# EasyEDA Pro project ad9854_lvgl.epro

# Schematic Schematic1
Board Name: Board2; Create Date: 2025-04-08; Page Name: P1; Project Name: ad9854+lvgl; Schematic Name: Schematic1; Update Date: 2025-04-08; Company: 嘉立创EDA; Page Size: A4; Version: V1.0
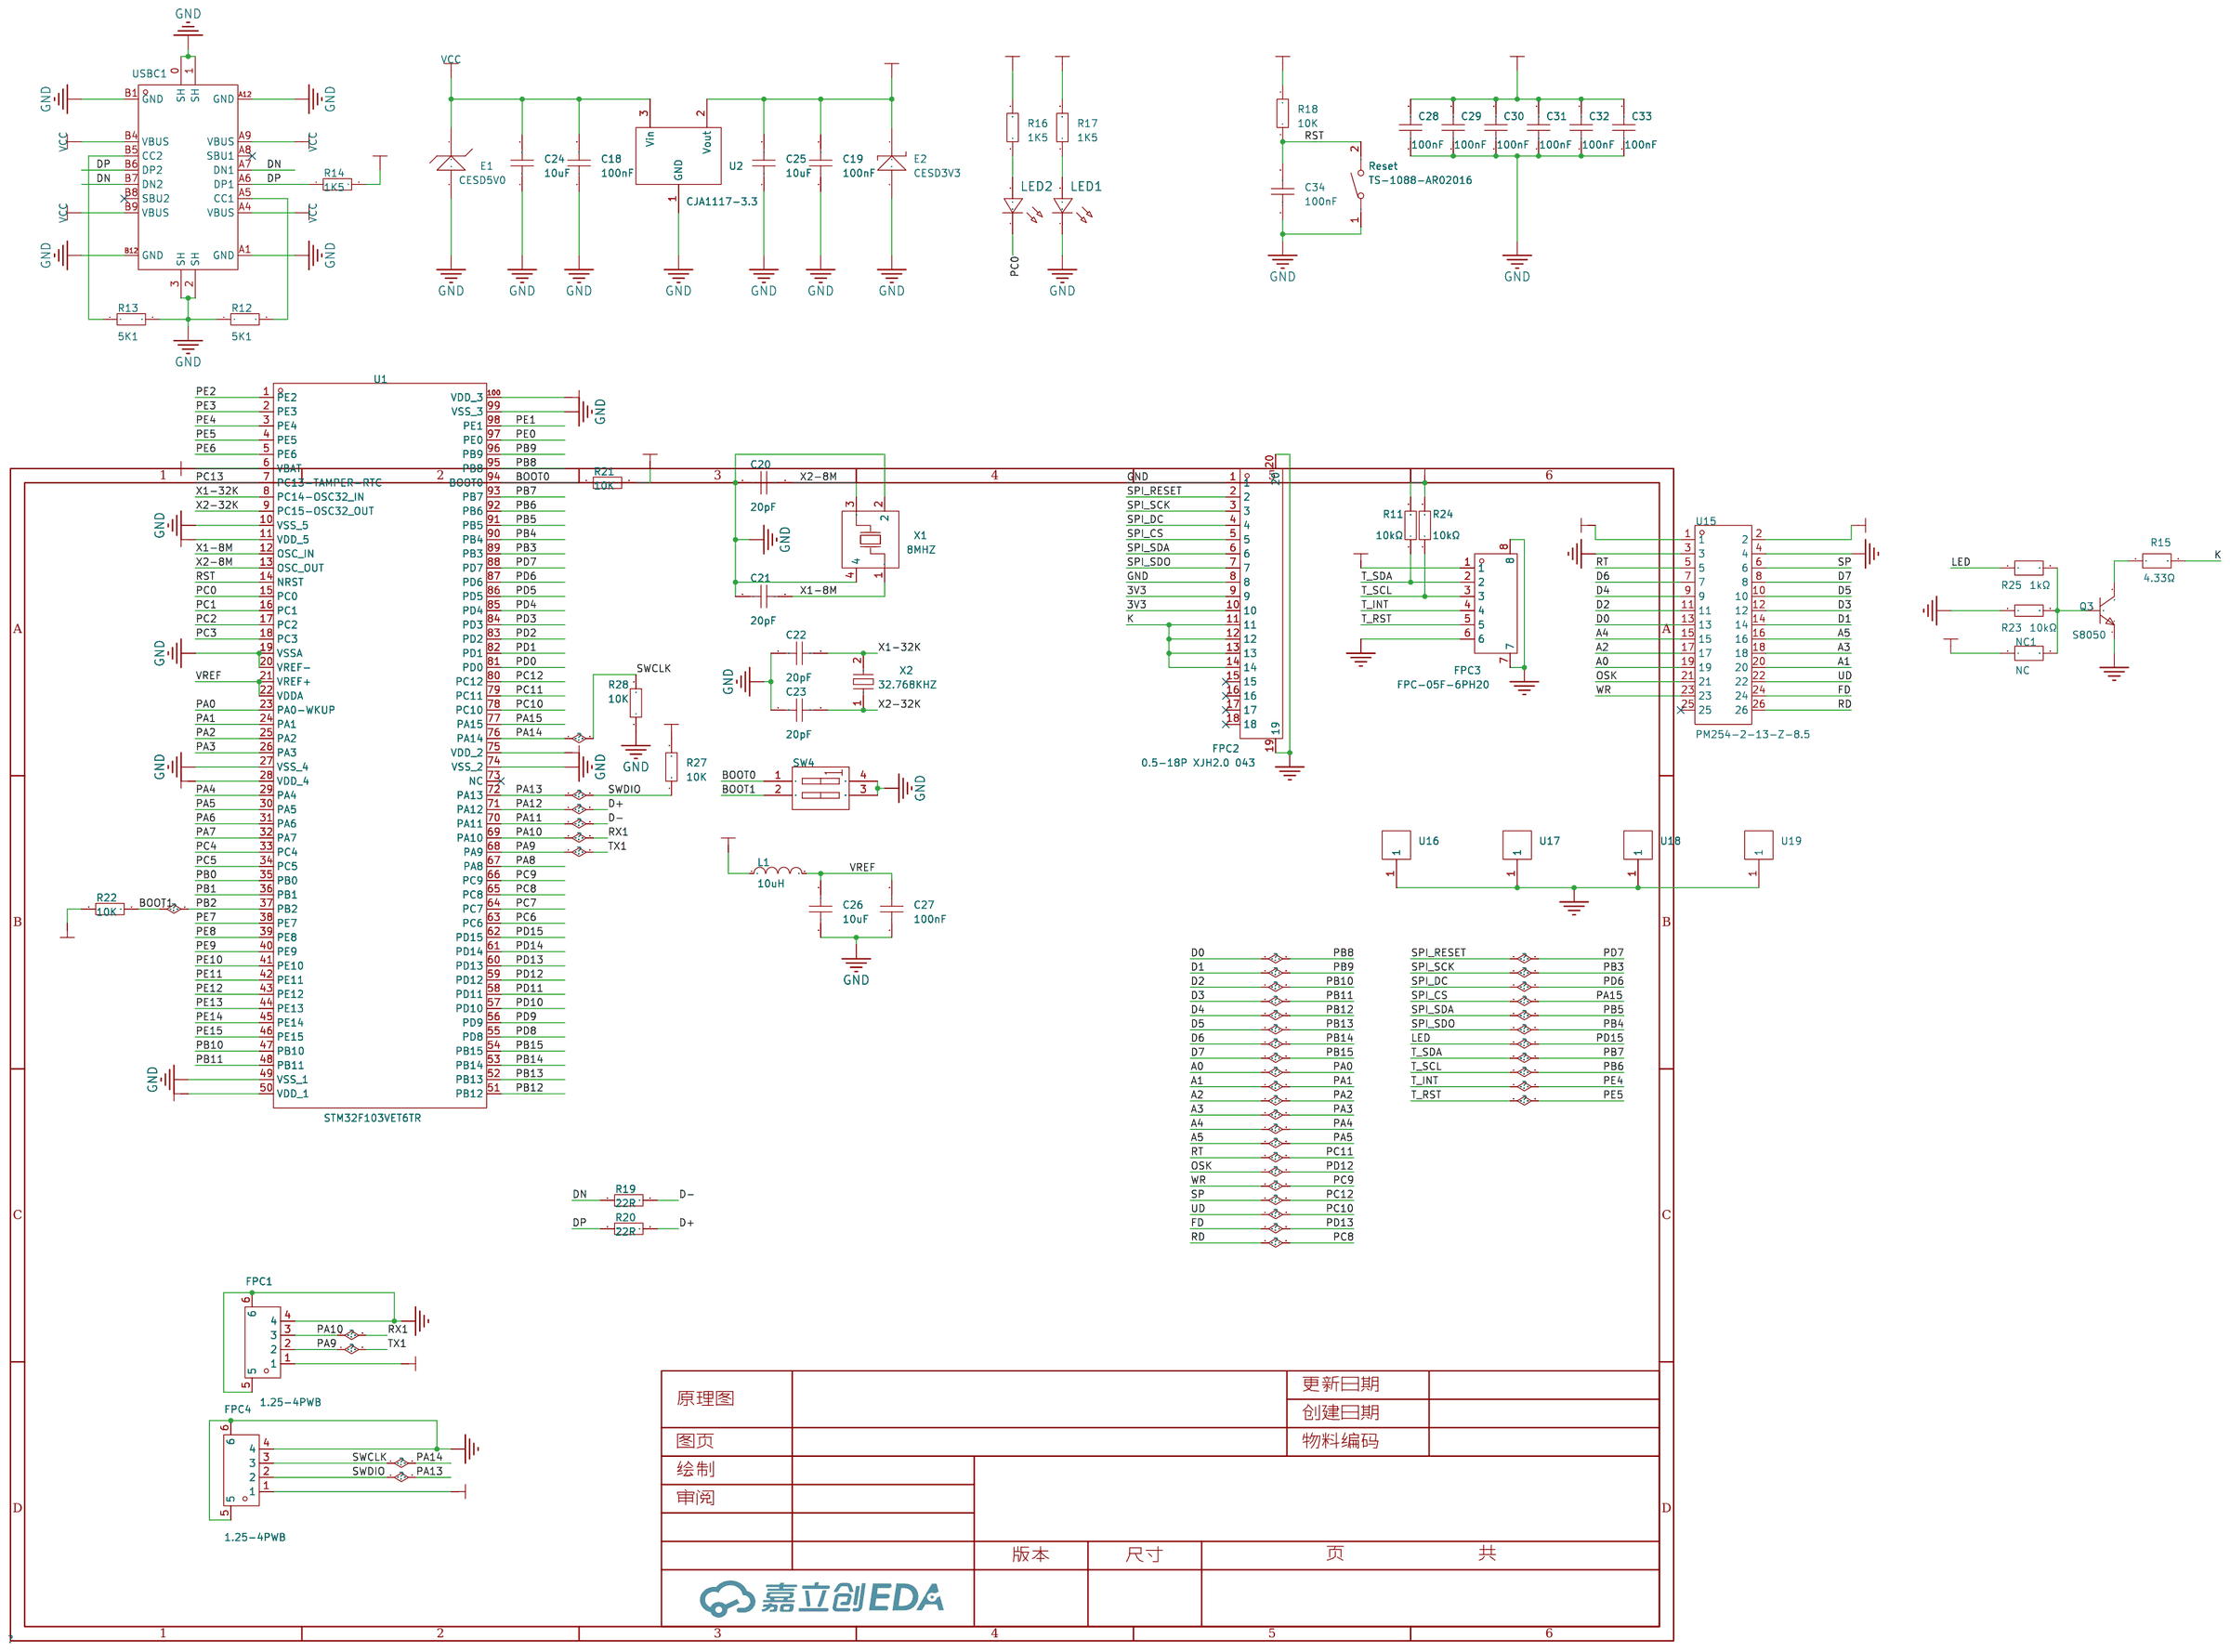
[diagram p0: schematic sheet]

## Parts
C18  100nF  [C0402]
C19  100nF  [C0402]
C20  20pF  [C0402]
C21  20pF  [C0402]
C22  20pF  [C0402]
C23  20pF  [C0402]
C24  10uF  [C0402]
C25  10uF  [C0402]
C26  10uF  [C0402]
C27  100nF  [C0402]
C28  100nF  [C0402]
C29  100nF  [C0402]
C30  100nF  [C0402]
C31  100nF  [C0402]
C32  100nF  [C0402]
C33  100nF  [C0402]
C34  100nF  [C0402]
E1  CESD5V0  [SOD-323_L1.8-W1.3-LS2.5-RD]
E2  CESD3V3  [SOD-323_L1.8-W1.3-LS2.5-RD]
FPC1  1.25-4PWB  [CONN-SMD_1.25-4PWB]
FPC2  0.5-18P XJH2.0 043  [FPC-SMD_18P-P0.50_XW05200-18]
FPC3  FPC-05F-6PH20  [FPC-SMD_6P-P0.50_XUNPU_FPC-05F-6PH20]
FPC4  1.25-4PWB  [CONN-SMD_1.25-4PWB]
L1  10uH  [L0603]
LED1  -  [LED_0603]
LED2  -  [LED_0603]
NC1  NC  [R0402]
Q3  S8050  [SOT-23-3_L2.9-W1.6-P1.90-LS2.8-BR]
R11  10kΩ  [R0402]
R12  5K1  [R0402]
R13  5K1  [R0402]
R14  1K5  [R0402]
R15  4.33Ω  [R0603]
R16  1K5  [R0402]
R17  1K5  [R0402]
R18  10K  [R0402]
R19  22R  [R0402]
R20  22R  [R0402]
R21  10K  [R0402]
R22  10K  [R0402]
R23  10kΩ  [R0402]
R24  10kΩ  [R0402]
R25  1kΩ  [R0402]
R27  10K  [R0402]
R28  10K  [R0402]
Reset  TS-1088-AR02016  [SW-SMD_L3.9-W3.0-P4.45]
SW4  DSHP02TSGET  [SW-SMD_4P_DSHP02TSGET]
U1  STM32F103VET6TR  [LQFP-100_L14.0-W14.0-P0.50-LS16.0-BL]
U2  CJA1117-3.3  [SOT-89-3_L4.5-W2.5-P1.50-LS4.2-BR]
U15  PM254-2-13-Z-8.5  [HDR-TH_26P-P2.54-V-F-R2-C13-S2.54-1]
U16  -  [M3梅花螺丝孔]
U17  -  [M3梅花螺丝孔]
U18  -  [M3梅花螺丝孔]
U19  -  [M3梅花螺丝孔]
USBC1  TYPE-C-31-M-12  [USB-C_SMD-TYPE-C-31-M-12]
X1  8MHZ  [OSC-SMD_4P-L3.2-W2.5-BL]
X2  32.768KHZ  [OSC-SMD_L3.2-W1.5]

## Library data of the parts
C18-C34 = CAP_0402: Supplier Footprint: 0402
E1 = CESD5V0D3 ZA: 极性:单向;反向截止电压(Vrwm):5V;击穿电压(VBR):6.2V;钳位电压(Vc)@Ipp:15.5V;; LCSC Part Name: 单向ESD; Supplier Part: C22643; Manufacturer: CJ(江苏长电/长晶); Supplier Footprint: SOD-323; JLCPCB Part Class: Extended Part; Datasheet: https://atta.szlcsc.com/upload/public/pdf/source/20140301/1457707004115.pdf; Supplier: LCSC; Polarity: 单向; Reverse Stand-Off Voltage (Vrwm): 5V; Breakdown Voltage (VBR): 6.2V; Peak Pulse Current(Ipp)@8/20us: 15A; Clamping Voltage@Ipp: 15.5V
E2 = CESD3V3D3 YU: 极性:单向;反向截止电压(Vrwm):3.3V;击穿电压(VBR):5V;钳位电压(Vc)@Ipp:13V;; LCSC Part Name: 单向ESD; Supplier Part: C38388; Manufacturer: CJ(江苏长电/长晶); Supplier Footprint: SOD-323; JLCPCB Part Class: Extended Part; Datasheet: https://atta.szlcsc.com/upload/public/pdf/source/20150915/1457707371129.pdf; Supplier: LCSC; Polarity: 单向; Reverse Stand-Off Voltage (Vrwm): 3.3V; Breakdown Voltage (VBR): 5V; Peak Pulse Current(Ipp)@8/20us: 16A; Clamping Voltage@Ipp: 13V
FPC1 FPC4 = 1.25-4PWB: 插针结构:1x4P;间距:1.25mm;安装方式:卧贴;参考系列:-;总PIN数:4P;排数:1;每排PIN数:4;行距:-;额定电流:-;工作温度范围:-40℃~+85℃;; LCSC Part Name: 1x4P 间距:1.25mm 卧贴; Supplier Part: C2905011; Manufacturer: DEALON(德艺隆); Supplier Footprint: SMD,P=1.25mm,卧贴; JLCPCB Part Class: 扩展库; Datasheet: https://atta.szlcsc.com/upload/public/pdf/source/20231123/1AE0876AE9C7DCFC0D68EAC4CBA881B0.pdf; Supplier: LCSC; Pins Structure: 1x4P; Pitch: 1.25mm; Mounting Style: 卧贴; Number of Pins: 4P; Number of Rows: 1; Number of PINs Per Row: 4; Operating Temperature Range: -40℃~+85℃
FPC2 = 0.5-18P XJH2.0 043: 锁定特性:翻盖式;触点类型:下接;触点数量:18P;间距:0.5mm;安装类型:卧贴;工作温度范围:-55℃~+85℃;; LCSC Part Name: 翻盖式 下接 P数:18P 间距:0.5mm; Supplier Part: C5373437; Manufacturer: SHOU HAN(首韩); Supplier Footprint: SMD,P=0.5mm,卧贴; JLCPCB Part Class: 扩展库; Datasheet: https://atta.szlcsc.com/upload/public/pdf/source/20230321/2194CD91B42FC0309001838B2742DAF5.pdf; Supplier: LCSC; Locking Feature: 翻盖式; Contact Type: 下接; Number of Contacts: 18P; Pitch: 0.5mm; Mounting Type: 卧贴; FFC, FCB Thickness: 0.3mm; Height Above Board: 2mm; Contact Material: 黄铜; Contact Plating: 锡; Operating Temperature Range: -55℃~+85℃
FPC3 = FPC-05F-6PH20: 锁定特性:翻盖式;触点类型:下接;触点数量:6P;间距:0.5mm;安装类型:卧贴;工作温度范围:-25℃~+85℃;; LCSC Part Name: 间距:0.5mm P数:6P 翻盖式 下接; Supplier Part: C2856796; Manufacturer: XUNPU(讯普); Supplier Footprint: SMD,P=0.5mm,卧贴; JLCPCB Part Class: 扩展库; Datasheet: https://atta.szlcsc.com/upload/public/pdf/source/20210922/16B003FB53336DDF6538142CC465AC4D.pdf; Supplier: LCSC; Locking Feature: 翻盖式; Contact Type: 下接; Number of Contacts: 6P; Pitch: 0.5mm; Mounting Type: 卧贴; FFC, FCB Thickness: 0.3mm; Height Above Board: 2mm; Operating Temperature Range: -25℃~+85℃
L1 = L_0603
LED1 LED2 = LED_0603-R: Supplier Footprint: 0603
NC1 R25 = RT0402BRD071KL: 电阻类型:薄膜电阻;阻值:1kΩ;精度:±0.1%;功率:62.5mW;最大工作电压:50V;温度系数:±25ppm/℃;; LCSC Part Name: 薄膜电阻 1kΩ ±0.1% 62.5mW; Supplier Part: C852624; Manufacturer: YAGEO(国巨); Supplier Footprint: 0402; JLCPCB Part Class: 扩展库; Datasheet: https://atta.szlcsc.com/upload/public/pdf/source/20210609/C852624_9EB141A274604F87C6BB037C8019D50A.pdf; Supplier: LCSC; Type: 薄膜电阻; Tolerance: ±0.1%; Power(Watts): 62.5mW; Overload Voltage (Max): 50V; Temperature Coefficient: ±25ppm/℃; Operating Temperature Range: -55℃~+155℃
Q3 = S8050_C181158: 晶体管类型:NPN;集电极电流(Ic):500mA;集射极击穿电压(Vceo):25V;功率(Pd):300mW;; LCSC Part Name: NPN 电流:500mA 耐压:25V; Supplier Part: C181158; Manufacturer: Hottech(合科泰); Supplier Footprint: SOT-23; JLCPCB Part Class: 扩展库; Datasheet: https://atta.szlcsc.com/upload/public/pdf/source/20220506/D987F39D56F2975D34EC7947E75C4ABC.pdf; Supplier: LCSC; Transistor Type: NPN; Collector Current (Ic): 500mA; Collector-Emitter Breakdown Voltage (Vceo): 25V; Power Dissipation (Pd): 300mW; Transition Frequency (fT): 150MHz; Collector Cut-Off Current (Icbo): 100nA; Collector-Emitter Saturation Voltage (VCE(sat)@Ic,Ib): 600mV@500mA,50mA
R11 R24 = 0402WGF1002TCE: 电阻类型:厚膜电阻;阻值:10kΩ;精度:±1%;功率:62.5mW;最大工作电压:50V;温度系数:±100ppm/℃;; LCSC Part Name: 10kΩ ±1% 62.5mW 厚膜电阻; Supplier Part: C25744; Manufacturer: UNI-ROYAL(厚声); Supplier Footprint: 0402; JLCPCB Part Class: Basic Part; Datasheet: https://atta.szlcsc.com/upload/public/pdf/source/20200306/C422600_1E6D84923E4A46A82E41ADD87F860B5C.pdf; Supplier: LCSC; Type: 厚膜电阻; Tolerance: ±1%; Power(Watts): 62.5mW; Overload Voltage (Max): 50V; Temperature Coefficient: ±100ppm/℃; Operating Temperature Range: -55℃~+155℃
R12-R14 R16-R22 R27 R28 = Res_0402: Supplier Footprint: 0402
R15 = CR164R33F: 电阻类型:厚膜电阻;阻值:4.33Ω;精度:±1%;功率:100mW;温度系数:±200ppm/℃;; LCSC Part Name: 厚膜电阻 4.33Ω ±1% 100mW; Supplier Part: C4144169; Manufacturer: Meritek; Supplier Footprint: 0603; JLCPCB Part Class: 扩展库; Datasheet: https://atta.szlcsc.com/upload/public/pdf/source/20240408/EFC32A6E0B04D07E4D8A435A440C47B4.pdf; Supplier: LCSC; Type: 厚膜电阻; Tolerance: ±1%; Power(Watts): 100mW; Temperature Coefficient: ±200ppm/℃; Operating Temperature: -55℃~+155℃
R23 = 0402WGF1002TCE: 电阻类型:厚膜电阻;阻值:10kΩ;精度:±1%;功率:62.5mW;最大工作电压:50V;温度系数:±100ppm/℃;; LCSC Part Name: 10kΩ ±1% 62.5mW 厚膜电阻; Supplier Part: C25744; Manufacturer: UNI-ROYAL(厚声); Supplier Footprint: 0402; JLCPCB Part Class: 基础库; Datasheet: https://atta.szlcsc.com/upload/public/pdf/source/20200306/C422600_1E6D84923E4A46A82E41ADD87F860B5C.pdf; Supplier: LCSC; Type: 厚膜电阻; Tolerance: ±1%; Power(Watts): 62.5mW; Overload Voltage (Max): 50V; Temperature Coefficient: ±100ppm/℃; Operating Temperature Range: -55℃~+155℃
Reset = TS-1088-AR02016: 电路结构:单刀单掷;按钮形状:圆形按钮;作用力:160gf;安装方式:立贴;开关长度:4mm;开关宽度:3mm;开关高度:2mm;带支架:不带;触点电流:50mA;额定电压(DC):12V;绝缘电阻:100MΩ;机械寿命:10万次;; LCSC Part Name: 4*3*2mm 立贴 轻触开关; Supplier Part: C720477; Manufacturer: XUNPU(讯普); Supplier Footprint: SMD; JLCPCB Part Class: 扩展库; Datasheet: https://atta.szlcsc.com/upload/public/pdf/source/20200810/C720475_60D09DD6C54279ADDB2DC25100F1CC11.pdf; Supplier: LCSC; Circuit: 单刀单掷; Actuator Style: 圆形按钮; Operating Force: 160gf; Mounting Style: 立贴; Switch Length: 4mm; Switch Width: 3mm; Switch Height: 2mm; Strike Gundam: 不带; Contact Current: 50mA; Voltage Rating (DC): 12V; Insulation Resistance: 100MΩ; Actuator/Cap Color: 黑色; Pin Style: SMD接片; Mechanical Life: 10万次; Operating Temperature: -30℃~+80℃
SW4 = DSHP02TSGET: 类型:平拨，凹槽式;电路结构:单刀单掷;开关位数:2;引脚间距:1.27mm;颜色:黑色;; LCSC Part Name: 2位 1.27间距; Supplier Part: C40735; Manufacturer: YE; Supplier Footprint: SMD-4P,4.1x5.4mm; JLCPCB Part Class: Extended Part; Datasheet: https://atta.szlcsc.com/upload/public/pdf/source/20150928/1457707425261.pdf; Supplier: LCSC; Type: 平拨，凹槽式; Circuit: 单刀单掷; Number of Positions: 2; Lead Pitch: 1.27mm; Color: 黑色
U1 = STM32F103VET6TR: Supplier Part: C2969762; Manufacturer: ST(意法半导体); Supplier Footprint: LQFP-100; JLCPCB Part Class: Extended Part; Datasheet: https://atta.szlcsc.com/upload/public/pdf/source/20221219/F073046C5082B3FD46C3C30E175C219E.pdf; Supplier: LCSC
U2 = CJA1117B-3.3: 输出类型:固定;输出极性:正;最大输入电压:15V;输出电压:3.3V;输出电流:1A;电源纹波抑制比(PSRR):75dB@(120Hz);; LCSC Part Name: 输入15V 输出3.3V 1A; Supplier Part: C24253; Manufacturer: CJ(江苏长电/长晶); Supplier Footprint: SOT-89-3; JLCPCB Part Class: Extended Part; Datasheet: https://atta.szlcsc.com/upload/public/pdf/source/20180420/C24253_F213F71107BF9C399B1291ED7BD22659.pdf; Supplier: LCSC; Output Type: 固定; Output Polarity: 正; Number of Outputs: 1; Maximum Input Voltage: 15V; Output Voltage: 3.3V; Dropout Voltage: 1.3V@(1A); Output Current: 1A; Power Supply Rejection Ratio (PSRR): 75dB@(120Hz)
U15 = PM254-2-13-Z-8.5: 插孔结构:2x13P;间距:2.54mm;行距:2.54mm;圆孔/方孔:方孔;安装类型:直插;排数:双排;总孔位数:26P;额定电流:3A;额定电压:-;插孔方向:顶部;塑高:8.5mm;触头材质:铜合金;工作温度范围:-40℃~+105℃;焊接温度(最大值):260℃@5S;; LCSC Part Name: 2x13P 间距:2.54mm 直插; Supplier Part: C2897414; Manufacturer: HCTL(华灿天禄); Supplier Footprint: 插件,P=2.54mm; JLCPCB Part Class: 扩展库; Datasheet: https://atta.szlcsc.com/upload/public/pdf/source/20230609/3D36CA2C1BFC9FD1C3F709AD9DFEB9C2.pdf; Supplier: LCSC; Holes Structure: 2x13P; Pitch: 2.54mm; Row Spacing: 2.54mm; Circular Hole / Square Hole: 方孔; Mounting Type: 直插; Number of Rows: 双排; Number of Holes: 26P; Current Rating (Max): 3A; Holes Direction: 顶部; Insulation Height: 8.5mm; Contact Material: 铜合金; Operating Temperature Range: -40℃~+105℃; Soldering Temperature(Max): 260℃@5S
U16-U19 = m3梅花孔
USBC1 = TYPE-C-31-M-12: 连接器类型:Type-C;标准:-;公母:母座;触点数量:16;端口数量:1;安装方式:-;额定电流 - 电源:5A;触头材质:-;触头镀层:-;工作温度范围:-;焊接温度(最大值):-;; LCSC Part Name: Type-C 母座; Supplier Part: C165948; Manufacturer: 韩国韩荣; Supplier Footprint: SMD; JLCPCB Part Class: Extended Part; Datasheet: https://atta.szlcsc.com/upload/public/pdf/source/20220525/466408E853115E789EDB0DDC29077C05.pdf; Supplier: LCSC; Connector Type: Type-C; Gender: 母座; Number of Contacts: 16; Number of Ports: 1; Current Rating - Power (Max): 5A
X1 = 1ZNY12000AB0C: 频率:-;负载电容:-;; LCSC Part Name: 12MHz 12pF; Supplier Part: C253730; Manufacturer: KDS(大真空); Supplier Footprint: SMD3225-4P; JLCPCB Part Class: Extended Part; Datasheet: https://atta.szlcsc.com/upload/public/pdf/source/20181030/C253730_A5AD184DBCCA8D7CEA7925AD8C22A254.pdf; Supplier: LCSC
X2 = NX3215SA 32.768KHZ STD-MUS-2: 频率:-;负载电容:-;; LCSC Part Name: 32.768KHz 12.5pF 20ppm 车载用 车载用; Supplier Part: C528990; Manufacturer: NDK; Supplier Footprint: SMD3215-2P; JLCPCB Part Class: Extended Part; Datasheet: https://atta.szlcsc.com/upload/public/pdf/source/20200522/C528990_CAEB74E6D3C1DA1C341F3FF5E0CE5BDF.pdf; Supplier: LCSC

## Nets
3V3: C19.2 C25.2 C28.2 C29.2 C30.2 C31.2 C32.2 C33.2 E2.1 FPC1.1 FPC2.9 FPC2.10 FPC3.1 FPC4.1 L1.1 NC1.1 R11.2 R14.2 R16.2 R17.2 R18.2 R21.2 R22.1 R24.2 R27.2 U1.6(VBAT) U1.11(VDD_5) U1.28(VDD_4) U1.50(VDD_1) U1.75(VDD_2) U1.100(VDD_3) U2.2(Vout)
GND: C18.1 C19.1 C20.1 C21.1 C22.1 C23.1 C24.1 C25.1 C26.1 C27.1 C28.1 C29.1 C30.1 C31.1 C32.1 C33.1 C34.1 E1.2 E2.2 FPC1.4 FPC1.5 FPC1.6 FPC2.1 FPC2.8 FPC2.19 FPC2.20 FPC3.6 FPC3.7 FPC3.8 FPC4.4 FPC4.5 FPC4.6 LED1.1(C) Q3.2 R12.1 R13.2 R23.1 R28.1 Reset.1 SW4.3(B2) SW4.4(B1) U1.10(VSS_5) U1.19(VSSA) U1.20(VREF-) U1.27(VSS_4) U1.49(VSS_1) U1.74(VSS_2) U1.99(VSS_3) U2.1(GND) U15.3 U15.4 U16.1 U17.1 U18.1 U19.1 USBC1.0(SH) USBC1.1(SH) USBC1.2(SH) USBC1.3(SH) USBC1.A1(GND) USBC1.A12(GND) USBC1.B1(GND) USBC1.B12(GND) X1.2 X1.4
VCC: C18.2 C24.2 E1.1 U2.3(Vin) U15.1 U15.2 USBC1.A4(VBUS) USBC1.A9(VBUS) USBC1.B4(VBUS) USBC1.B9(VBUS)
A0: U1.23(PA0-WKUP) U15.19
A1: U1.24(PA1) U15.20
A2: U1.25(PA2) U15.17
A3: U1.26(PA3) U15.18
A4: U1.29(PA4) U15.15
A5: U1.30(PA5) U15.16
BOOT0: R21.1 SW4.1(A1) U1.94(BOOT0)
BOOT1: R22.2 SW4.2(A2) U1.37(PB2)
D0: U1.95(PB8) U15.13
D1: U1.96(PB9) U15.14
D2: U1.47(PB10) U15.11
D3: U1.48(PB11) U15.12
D4: U1.51(PB12) U15.9
D5: U1.52(PB13) U15.10
D6: U1.53(PB14) U15.7
D7: U1.54(PB15) U15.8
D+: R20.2 U1.71(PA12)
D-: R19.2 U1.70(PA11)
DN: R19.1 USBC1.A7(DN1) USBC1.B7(DN2)
DP: R14.1 R20.1 USBC1.A6(DP1) USBC1.B6(DP2)
FD: U1.60(PD13) U15.24
K: FPC2.11 FPC2.12 FPC2.13 FPC2.14 R15.2
LED: R25.1 U1.62(PD15)
OSK: U1.59(PD12) U15.21
PA6: U1.31(PA6)
PA7: U1.32(PA7)
PA8: U1.67(PA8)
PA9: FPC1.2 U1.68(PA9)
PA10: FPC1.3 U1.69(PA10)
PA13: FPC4.2 R27.1 U1.72(PA13)
PA14: FPC4.3 R28.2 U1.76(PA14)
PA15: FPC2.5 U1.77(PA15)
PB0: U1.35(PB0)
PB1: U1.36(PB1)
PB3: FPC2.3 U1.89(PB3)
PB4: FPC2.7 U1.90(PB4)
PB5: FPC2.6 U1.91(PB5)
PB6: FPC3.3 R24.1 U1.92(PB6)
PB7: FPC3.2 R11.1 U1.93(PB7)
PC0: LED2.1(C) U1.15(PC0)
PC1: U1.16(PC1)
PC2: U1.17(PC2)
PC3: U1.18(PC3)
PC4: U1.33(PC4)
PC5: U1.34(PC5)
PC6: U1.63(PC6)
PC7: U1.64(PC7)
PC8: U1.65(PC8) U15.26
PC9: U1.66(PC9) U15.23
PC10: U1.78(PC10) U15.22
PC11: U1.79(PC11) U15.5
PC12: U1.80(PC12) U15.6
PC13: U1.7(PC13-TAMPER-RTC)
PD0: U1.81(PD0)
PD1: U1.82(PD1)
PD2: U1.83(PD2)
PD3: U1.84(PD3)
PD4: U1.85(PD4)
PD5: U1.86(PD5)
PD6: FPC2.4 U1.87(PD6)
PD7: FPC2.2 U1.88(PD7)
PD8: U1.55(PD8)
PD9: U1.56(PD9)
PD10: U1.57(PD10)
PD11: U1.58(PD11)
PD14: U1.61(PD14)
PE0: U1.97(PE0)
PE1: U1.98(PE1)
PE2: U1.1(PE2)
PE3: U1.2(PE3)
PE4: FPC3.4 U1.3(PE4)
PE5: FPC3.5 U1.4(PE5)
PE6: U1.5(PE6)
PE7: U1.38(PE7)
PE8: U1.39(PE8)
PE9: U1.40(PE9)
PE10: U1.41(PE10)
PE11: U1.42(PE11)
PE12: U1.43(PE12)
PE13: U1.44(PE13)
PE14: U1.45(PE14)
PE15: U1.46(PE15)
RST: C34.2 R18.1 Reset.2 U1.14(NRST)
VREF: C26.2 C27.2 L1.2 U1.21(VREF+) U1.22(VDDA)
X1-8M: C21.2 U1.12(OSC_IN) X1.1(OSC1)
X1-32K: C22.2 U1.8(PC14-OSC32_IN) X2.2
X2-8M: C20.2 U1.13(OSC_OUT) X1.3(OSC2)
X2-32K: C23.2 U1.9(PC15-OSC32_OUT) X2.1
$1N2566: R13.1 USBC1.B5(CC2)
$1N2567: R12.2 USBC1.A5(CC1)
$1N2763: LED1.2(A) R17.1
$1N2765: LED2.2(A) R16.1
$1N3601: NC1.2 Q3.1 R23.2 R25.2
$1N3606: Q3.3 R15.1

Not connected (* = marked no-connect by the designer): FPC2 15* 16* 17* 18*; U1 73(NC)*; U15 25*; USBC1 A8(SBU1)* B8(SBU2)*

# Board PCB4
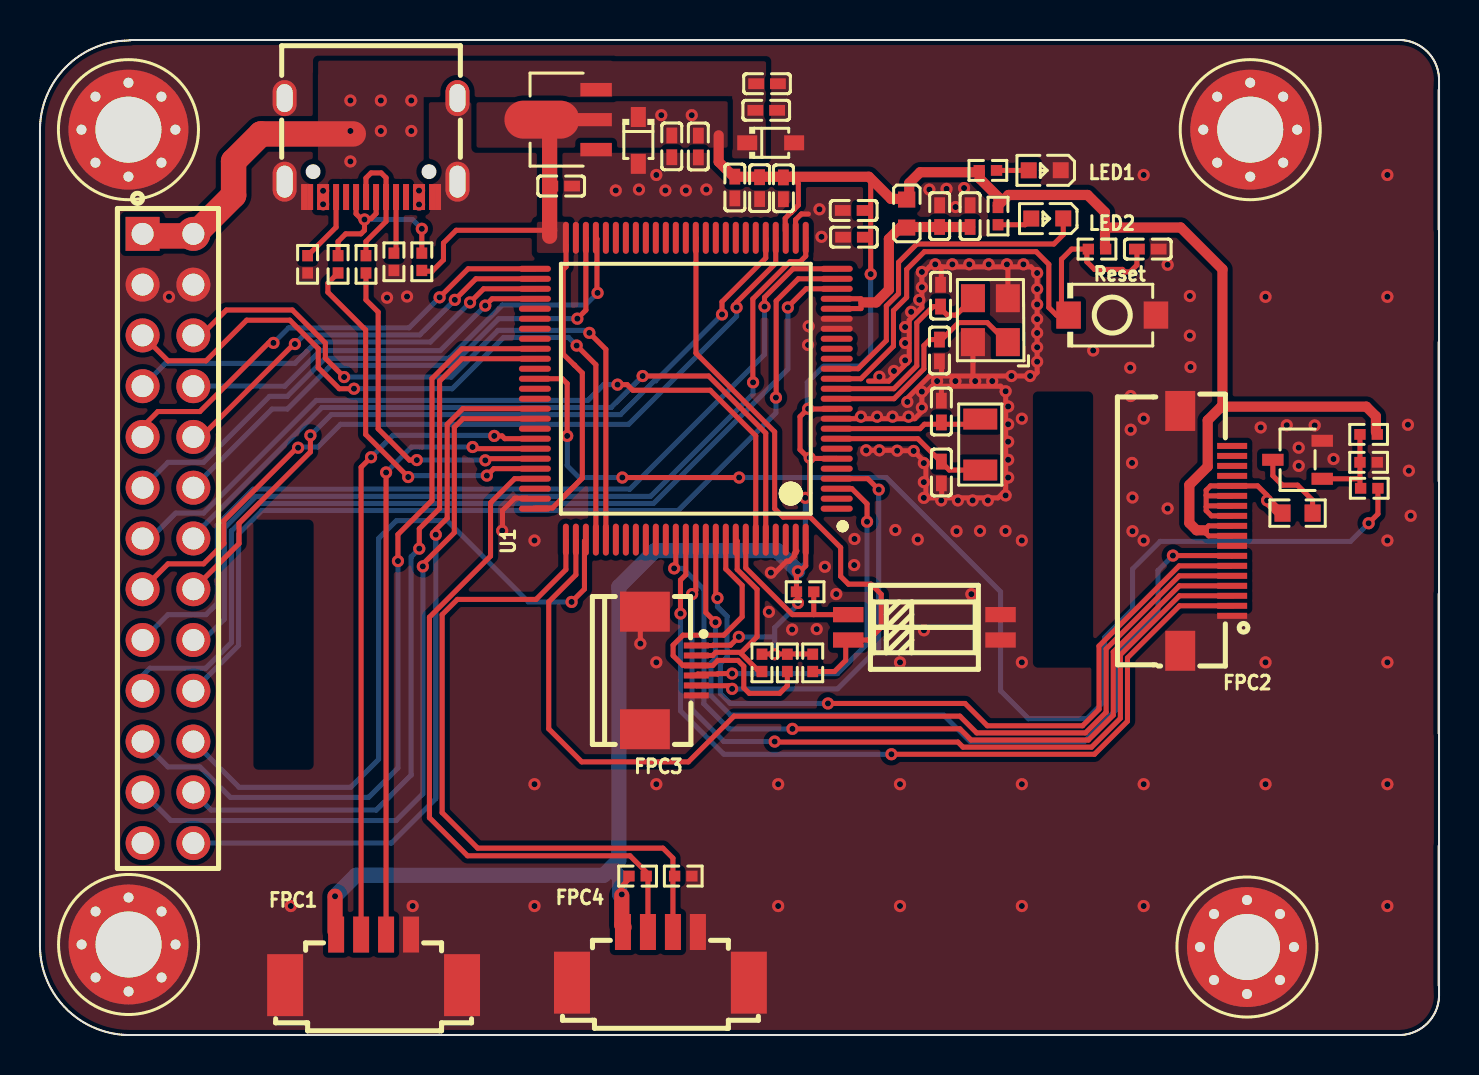
[diagram p1: board, top side]
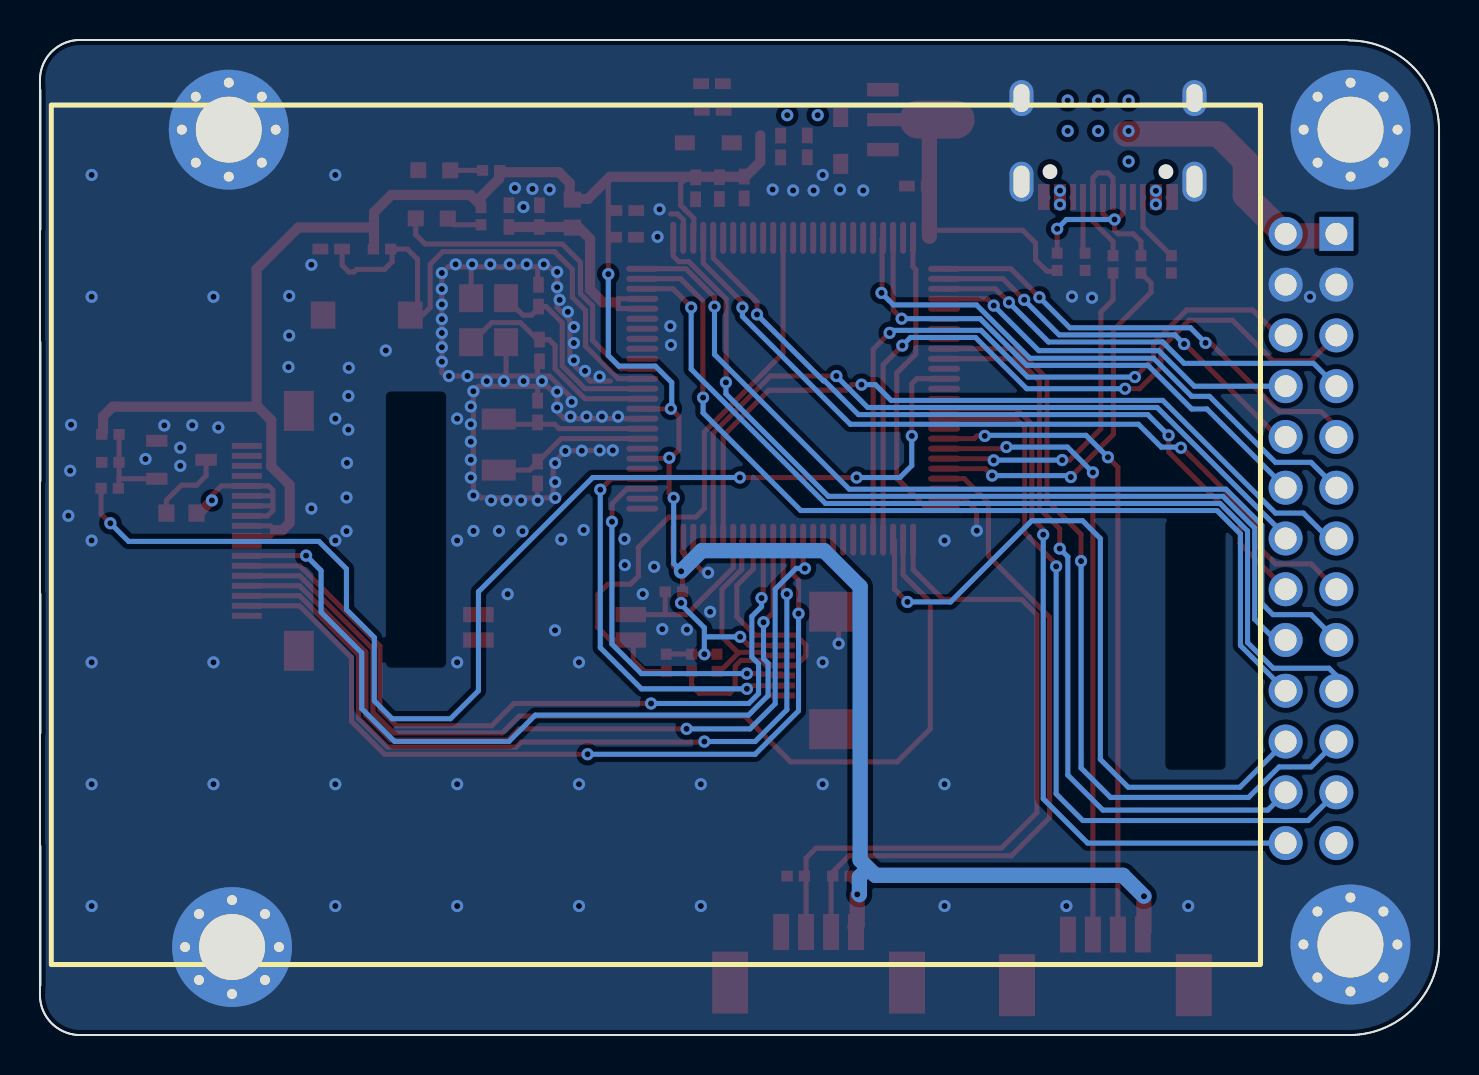
[diagram p2: board, bottom side, seen from below]

Outline 70 x 49.78 mm; copper layers: Top Layer, Bottom Layer. Coordinates in mm from the lower left corner of the outline.
Outline path: 0,45.32 0,45.42 0.01,45.51 0.01,45.61 0.02,45.71 0.03,45.8 0.04,45.89 0.06,45.99 0.07,46.08 0.09,46.17 0.11,46.27 0.13,46.36 0.15,46.45 0.18,46.54 0.21,46.63 0.23,46.71 0.27,46.8 0.3,46.89 0.33,46.97 0.37,47.06 0.4,47.14 0.44,47.23 0.48,47.31 0.53,47.39 0.57,47.47 0.62,47.55 0.66,47.62 0.71,47.7 0.76,47.78 0.81,47.85 0.87,47.93 0.92,48 0.98,48.07 1.04,48.14 1.09,48.21 1.15,48.28 1.22,48.34 1.28,48.41 1.34,48.47 1.41,48.54 1.47,48.6 1.54,48.66 1.61,48.72 1.68,48.77 1.75,48.83 1.83,48.88 1.9,48.94 1.97,48.99 2.05,49.04 2.13,49.09 2.21,49.13 2.28,49.18 2.36,49.22 2.45,49.27 2.53,49.31 2.61,49.35 2.69,49.38 2.78,49.42 2.86,49.45 2.95,49.49 3.04,49.52 3.13,49.55 3.22,49.57 3.31,49.6 3.4,49.62 3.49,49.65 3.58,49.67 3.67,49.68 3.76,49.7 3.86,49.71 3.95,49.73 4.05,49.74 4.14,49.75 4.24,49.75 4.34,49.76 4.43,49.76 4.53,49.76 ; 0,45.28 0,4.41 0,4.32 0.01,4.22 0.01,4.12 0.02,4.03 0.03,3.93 0.04,3.84 0.06,3.75 0.08,3.65 0.09,3.56 0.11,3.47 0.14,3.38 0.16,3.29 0.18,3.2 0.21,3.11 0.24,3.02 0.27,2.94 0.3,2.85 0.34,2.77 0.38,2.68 0.41,2.6 0.45,2.52 0.49,2.43 0.54,2.35 0.58,2.27 0.63,2.2 0.67,2.12 0.72,2.04 0.77,1.97 0.82,1.89 0.88,1.82 0.93,1.74 0.99,1.67 1.05,1.6 1.11,1.54 1.17,1.47 1.23,1.4 1.29,1.34 1.36,1.27 1.42,1.21 1.49,1.15 1.56,1.09 1.63,1.03 1.7,0.97 1.77,0.92 1.84,0.86 1.91,0.81 1.99,0.76 2.07,0.71 2.14,0.66 2.22,0.61 2.3,0.57 2.38,0.52 2.46,0.48 2.55,0.44 2.63,0.4 2.71,0.37 2.8,0.33 2.88,0.3 2.97,0.26 3.06,0.23 3.15,0.2 3.24,0.18 3.33,0.15 3.42,0.13 3.51,0.11 3.6,0.09 3.69,0.07 3.79,0.06 3.88,0.04 3.98,0.03 4.07,0.02 4.17,0.01 4.26,0.01 4.36,0 4.46,0 67.98,0 68.04,0 68.11,0 68.18,0.01 68.24,0.02 68.31,0.02 68.37,0.04 68.44,0.05 68.5,0.06 68.56,0.08 68.62,0.1 68.68,0.12 68.74,0.14 68.8,0.17 68.86,0.2 68.92,0.22 68.97,0.25 69.03,0.29 69.08,0.32 69.13,0.35 69.18,0.39 69.23,0.43 69.28,0.47 69.33,0.51 69.38,0.55 69.42,0.6 69.47,0.64 69.51,0.69 69.55,0.74 69.59,0.78 69.62,0.84 69.66,0.89 69.69,0.94 69.73,0.99 69.76,1.05 69.79,1.1 69.82,1.16 69.84,1.22 69.86,1.28 69.89,1.34 69.91,1.4 69.93,1.46 69.94,1.52 69.96,1.59 69.97,1.65 69.98,1.72 69.99,1.78 69.99,1.85 70,1.91 70,1.98 70,47.77 70,47.84 70,47.9 69.99,47.97 69.98,48.04 69.97,48.1 69.96,48.17 69.95,48.23 69.93,48.29 69.92,48.35 69.9,48.41 69.88,48.47 69.85,48.53 69.83,48.59 69.8,48.65 69.77,48.71 69.74,48.76 69.71,48.82 69.68,48.87 69.64,48.92 69.61,48.97 69.57,49.02 69.53,49.07 69.49,49.12 69.44,49.16 69.4,49.21 69.35,49.25 69.31,49.29 69.26,49.33 69.21,49.37 69.16,49.41 69.11,49.45 69.05,49.48 69,49.51 68.95,49.54 68.89,49.57 68.83,49.6 68.77,49.63 68.71,49.65 68.65,49.67 68.59,49.69 68.53,49.71 68.47,49.73 68.4,49.74 68.34,49.75 68.28,49.76 68.21,49.77 68.14,49.78 68.08,49.78 68.01,49.78 ; 4.5,49.78 67.99,49.78 ; 69.97,40.3 69.97,47.28 ; 69.97,27.71 69.97,34.66 ; 69.97,15.09 69.97,22.07 ; 69.97,2.48 69.97,9.46
Stack: Top Layer 0.035mm / Dielectric1 1.51mm FR4 er 4.5 / Bottom Layer 0.035mm

## Design rules (mm)
template: 自定义配置
spacing copperThickness1oz (default): track to track 0.102, other pairs 0.152 to 0.3
spacing copperThickness2oz: track to track 0.203, other pairs 0.152 to 0.3
track width copperThickness1oz (default): min 0.127, default 0.254, max 2.54
track width copperThickness2oz: min 0.203, default 0.254, max 2.54
differential pair differentialPair (default): width min 0.127, default 0.254, max 2.54; gap min 0.152, default 0.152
via viaSize (default): diameter min 0.5, default 0.61, max 10; hole min 0.3, default 0.305, max 6.3

## Placement (name value [footprint] x y rotation side)
C18  100nF  [C0402]  36.38 47.6 180 top
C19  100nF  [C0402]  32.94 44.45 90 top
C20  20pF  [C0402]  45.06 36.99 270 top
C21  20pF  [C0402]  45 34.25 90 top
C22  20pF  [C0402]  45.1 28.14 90 top
C23  20pF  [C0402]  45.1 31.19 270 top
C24  10uF  [C0402]  36.34 46.26 180 top
C25  10uF  [C0402]  31.61 44.46 90 top
C26  10uF  [C0402]  45.01 40.97 270 top
C27  100nF  [C0402]  46.54 40.97 270 top
C28  100nF  [C0402]  26.08 42.47 180 top
C29  100nF  [C0402]  34.77 42.4 90 top
C30  100nF  [C0402]  36 42.37 90 top
C31  100nF  [C0402]  37.2 42.36 90 top
C32  100nF  [C0402]  40.72 39.92 0 top
C33  100nF  [C0402]  40.71 41.25 0 top
C34  100nF  [C0402]  55.43 39.32 180 top
E1  CESD5V0  [SOD-323_L1.8-W1.3-LS2.5-RD]  36.56 44.64 0 top
E2  CESD3V3  [SOD-323_L1.8-W1.3-LS2.5-RD]  29.94 44.76 270 top
FPC1  1.25-4PWB  [CONN-SMD_1.25-4PWB]  16.69 3.76 0 top
FPC2  0.5-18P XJH2.0 043  [FPC-SMD_18P-P0.50_XW05200-18]  58.35 25.22 270 top
FPC3  FPC-05F-6PH20  [FPC-SMD_6P-P0.50_XUNPU_FPC-05F-6PH20]  31.55 18.24 270 top
FPC4  1.25-4PWB  [CONN-SMD_1.25-4PWB]  31.04 3.89 0 top
L1  10uH  [L0603]  43.36 41.1 270 top
LED1  -  [LED_0603]  50.22 43.26 180 top
LED2  -  [LED_0603]  50.35 40.84 180 top
NC1  NC  [R0402]  66.48 30.05 180 top
Q3  S8050  [SOT-23-3_L2.9-W1.6-P1.90-LS2.8-BR]  62.92 28.78 0 top
R11  10kΩ  [R0402]  36.12 18.62 90 top
R12  5K1  [R0402]  17.71 38.69 90 top
R13  5K1  [R0402]  13.39 38.56 270 top
R14  1K5  [R0402]  19.11 38.69 270 top
R15  4.33Ω  [R0603]  62.92 26.11 180 top
R16  1K5  [R0402]  47.93 40.97 90 top
R17  1K5  [R0402]  47.43 43.26 180 top
R18  10K  [R0402]  52.89 39.32 0 top
R19  22R  [R0402]  16.31 38.56 270 top
R20  22R  [R0402]  14.91 38.56 270 top
R21  10K  [R0402]  38.28 22.18 180 top
R22  10K  [R0402]  38.66 18.62 270 top
R23  10kΩ  [R0402]  66.48 28.65 180 top
R24  10kΩ  [R0402]  37.39 18.62 90 top
R25  1kΩ  [R0402]  66.51 27.35 180 top
R27  10K  [R0402]  29.9 7.95 180 top
R28  10K  [R0402]  32.19 7.95 180 top
Reset  TS-1088-AR02016  [SW-SMD_L3.9-W3.0-P4.45]  53.65 36.02 180 top
SW4  DSHP02TSGET  [SW-SMD_4P_DSHP02TSGET]  44.25 20.4 270 top
U1  STM32F103VET6TR  [LQFP-100_L14.0-W14.0-P0.50-LS16.0-BL]  32.31 32.34 90 top
U2  CJA1117-3.3  [SOT-89-3_L4.5-W2.5-P1.50-LS4.2-BR]  26.47 45.8 0 top
U15  PM254-2-13-Z-8.5  [HDR-TH_26P-P2.54-V-F-R2-C13-S2.54-1]  6.41 24.84 270 top
U16  -  [M3梅花螺丝孔]  4.43 4.53 0 top
U17  -  [M3梅花螺丝孔]  4.43 45.3 0 top
U18  -  [M3梅花螺丝孔]  60.39 4.4 0 top
U19  -  [M3梅花螺丝孔]  60.55 45.3 0 top
USBC1  TYPE-C-31-M-12  [USB-C_SMD-TYPE-C-31-M-12]  16.57 44.4 180 top
X1  8MHZ  [OSC-SMD_4P-L3.2-W2.5-BL]  47.55 35.76 90 top
X2  32.768KHZ  [OSC-SMD_L3.2-W1.5]  47.05 29.54 270 top

## Footprints (pads in the part's own frame, mm; a bottom-side part is the same pattern mirrored in y, then rotated)
C0402
  rect 0.79x0.54 smd: 1(-0.545,0) 2(0.545,0)
CONN-SMD_1.25-4PWB
  rect 0.8x1.8 smd: 1(-1.875,1.266) 2(-0.625,1.266) 3(0.625,1.266) 4(1.875,1.266)
  rect 1.8x3.1 smd: 5(-4.425,-1.266) 6(4.425,-1.266)
FPC-SMD_6P-P0.50_XUNPU_FPC-05F-6PH20
  rect 0.3x1.25 smd: 1(-1.25,1.288) 2(-0.75,1.288) 3(-0.25,1.288) 4(0.25,1.288) 5(0.75,1.288) 6(1.25,1.288)
  rect 2x2.5 smd: 7(2.94,-1.288) 8(-2.94,-1.288)
FPC-SMD_18P-P0.50_XW05200-18
  rect 0.3x1.5 smd: 1(4.25,1.3) 2(3.75,1.3) 3(3.25,1.3) 4(2.75,1.3) 5(2.25,1.3) 6(1.75,1.3) 7(1.25,1.3) 8(0.75,1.3) 9(0.25,1.3) 10(-0.25,1.3) 11(-0.75,1.3) 12(-1.25,1.3) 13(-1.75,1.3) 14(-2.25,1.3) 15(-2.75,1.3) 16(-3.25,1.3) 17(-3.75,1.3) 18(-4.25,1.3)
  rect 2x1.5 smd: 19(-6,-1.3) 20(6,-1.3)
HDR-TH_26P-P2.54-V-F-R2-C13-S2.54-1
  rect 1.7x1.7 hole 1.1: 1(-15.24,-1.27)
  round 1.7 hole 1.1: 2(-15.24,1.27) 3(-12.7,-1.27) 4(-12.7,1.27) 5(-10.16,-1.27) 6(-10.16,1.27) 7(-7.62,-1.27) 8(-7.62,1.27) 9(-5.08,-1.27) 10(-5.08,1.27) 11(-2.54,-1.27) 12(-2.54,1.27) 13(0,-1.27) 14(0,1.27) 15(2.54,-1.27) 16(2.54,1.27) 17(5.08,-1.27) 18(5.08,1.27) 19(7.62,-1.27) 20(7.62,1.27) 21(10.16,-1.27) 22(10.16,1.27) 23(12.7,-1.27) 24(12.7,1.27) 25(15.24,-1.27) 26(15.24,1.27)
L0603
  rect 0.8x0.864 smd: 1(-0.7,0) 2(0.7,0)
LED_0603
  rect 0.8x0.8 smd: 1(-0.851,-0.01) 2(0.75,-0.005)
LQFP-100_L14.0-W14.0-P0.50-LS16.0-BL
  oval 0.3x1.6 smd: 1(-6,-7.55) 2(-5.5,-7.55) 3(-5,-7.55) 4(-4.5,-7.55) 5(-4,-7.55) 6(-3.5,-7.55) 7(-3,-7.55) 8(-2.5,-7.55) 9(-2,-7.55) 10(-1.5,-7.55) 11(-1,-7.55) 12(-0.5,-7.55) 13(0,-7.55) 14(0.5,-7.55) 15(1,-7.55) 16(1.5,-7.55) 17(2,-7.55) 18(2.5,-7.55) 19(3,-7.55) 20(3.5,-7.55) 21(4,-7.55) 22(4.5,-7.55) 23(5,-7.55) 24(5.5,-7.55) 25(6,-7.55) 51(6,7.55) 52(5.5,7.55) 53(5,7.55) 54(4.5,7.55) 55(4,7.55) 56(3.5,7.55) 57(3,7.55) 58(2.5,7.55) 59(2,7.55) 60(1.5,7.55) 61(1,7.55) 62(0.5,7.55) 63(0,7.55) 64(-0.5,7.55) 65(-1,7.55) 66(-1.5,7.55) 67(-2,7.55) 68(-2.5,7.55) 69(-3,7.55) 70(-3.5,7.55) 71(-4,7.55) 72(-4.5,7.55) 73(-5,7.55) 74(-5.5,7.55) 75(-6,7.55)
  oval 1.6x0.3 smd: 26(7.55,-6) 27(7.55,-5.5) 28(7.55,-5) 29(7.55,-4.5) 30(7.55,-4) 31(7.55,-3.5) 32(7.55,-3) 33(7.55,-2.5) 34(7.55,-2) 35(7.55,-1.5) 36(7.55,-1) 37(7.55,-0.5) 38(7.55,0) 39(7.55,0.5) 40(7.55,1) 41(7.55,1.5) 42(7.55,2) 43(7.55,2.5) 44(7.55,3) 45(7.55,3.5) 46(7.55,4) 47(7.55,4.5) 48(7.55,5) 49(7.55,5.5) 50(7.55,6) 76(-7.55,6) 77(-7.55,5.5) 78(-7.55,5) 79(-7.55,4.5) 80(-7.55,4) 81(-7.55,3.5) 82(-7.55,3) 83(-7.55,2.5) 84(-7.55,2) 85(-7.55,1.5) 86(-7.55,1) 87(-7.55,0.5) 88(-7.55,0) 89(-7.55,-0.5) 90(-7.55,-1) 91(-7.55,-1.5) 92(-7.55,-2) 93(-7.55,-2.5) 94(-7.55,-3) 95(-7.55,-3.5) 96(-7.55,-4) 97(-7.55,-4.5) 98(-7.55,-5) 99(-7.55,-5.5) 100(-7.55,-6)
M3梅花螺丝孔
  round 1 hole 0.5: 1(-2.349,0) 1(-1.651,1.651) 1(-1.651,-1.651) 1(0,2.349) 1(0,-2.349) 1(1.651,1.651) 1(1.651,-1.651) 1(2.349,0)
  round 6 hole 3.302: 1(0,0)
OSC-SMD_4P-L3.2-W2.5-BL
  rect 1.4x1.2 smd: 1(-1.1,-0.875) 2(1.1,-0.875) 3(1.1,0.875) 4(-1.1,0.875)
OSC-SMD_L3.2-W1.5
  rect 1.05x1.7 smd: 1(-1.275,0) 2(1.275,0)
R0402
  rect 0.566x0.54 smd: 1(-0.433,0) 2(0.433,0)
R0603
  rect 0.806x0.864 smd: 1(-0.753,0) 2(0.753,0)
SOD-323_L1.8-W1.3-LS2.5-RD
  rect 1x0.75 smd: 1(-1.173,0) 2(1.173,0)
SOT-23-3_L2.9-W1.6-P1.90-LS2.8-BR
  rect 1.07x0.6 smd: 1(1.235,-0.95) 2(1.235,0.95) 3(-1.235,0)
SOT-89-3_L4.5-W2.5-P1.50-LS4.2-BR
  rect 1.575x0.672 smd: 1(1.356,-1.5) 3(1.356,1.5)
  custom 5.377x1.9 smd: 2(-1.356,0)
SW-SMD_4P_DSHP02TSGET
  rect 0.762x1.524 smd: 1(-0.635,-3.81) 2(0.635,-3.81) 3(0.635,3.81) 4(-0.635,3.81)
SW-SMD_L3.9-W3.0-P4.45
  rect 1.23x1.36 smd: 1(-2.185,0) 2(2.185,0)
USB-C_SMD-TYPE-C-31-M-12
  oval 1.2x2 hole 0.8x1.6: 0(-4.325,1.706) 1(4.325,1.706)
  oval 1.2x1.8 hole 0.8x1.4: 2(4.325,-2.474) 3(-4.325,-2.474)
  rect 0.3x1.3 smd: A1(-3.35,2.474) A4(-2.55,2.474) A5(-1.25,2.474) A6(-0.25,2.474) A7(0.25,2.474) A8(1.25,2.474) A9(2.55,2.474) A12(3.35,2.474) B1(3.05,2.474) B4(2.25,2.474) B5(1.75,2.474) B6(0.75,2.474) B7(-0.75,2.474) B8(-1.75,2.474) B9(-2.25,2.474) B12(-3.05,2.474)

## Nets
As in the schematic.

Pads without a net: FPC2 15 16 17 18; U1 73; U15 25; USBC1 A8 B8

## Via types
v1: diameter 0.61, hole 0.305, Top Layer to Bottom Layer, 218 vias

## Routing (per net, layer and track width the routed paths; a pad name or vN(x,y) marks a point on that pad's centre or on a via; arc(x,y) is an arc through that point)
3V3: length 172.3
  Top Layer w0.254: FPC2.10 58.47,25.47 58.35,25.35 58.35,25.1 58.48,24.97 59.64,24.97 FPC2.9 ; U1.100 38.31,23.48 37.85,23.01 R21.2 ; 24.76,26.37 25.64,26.37 26.24,26.97 ; 36.1,19.06 38.66,19.06 38.68,19.04 ; 27.13,27.87 27.13,33.12 26.75,33.5 ; 27.13,27.87 27.13,27.86 26.24,26.97 ; 27.13,27.87 26.24,26.97 ; 38.52,28.85 39.85,28.85 U1.6 ; v1(41.56,38.07) 41.56,42.71 41.59,42.75 ; 26.75,33.5 26.71,33.55 ; 26.75,33.5 26.18,34.06 26.18,38.29 26.32,38.44 26.32,39.51 ; v1(38.29,26.88) 38.52,27.1 38.52,28.73 ; 38.47,28.85 38.03,29.29 38.03,30.94 38.41,31.32 39.85,31.32 U1.11 ; 19.21,38.21 19.62,38.21 20.19,38.78 20.19,39.63 20.83,40.26 25.56,40.26 ; 37.92,21.57 37.91,21.58 37.91,21.98 ; 29.07,7.4 29.49,7.83 ; 33.27,19.49 33.65,19.49 33.67,19.5 34.55,19.5 34.88,19.83 ; 37.28,40.24 37.28,40.86 37.57,41.14 37.58,41.14 37.75,41.31 37.75,41.32 37.94,41.52 37.94,42.59 37.59,42.94 37.54,43
  Top Layer w0.508: 47.92,41.49 47.95,41.52 ; 47.95,41.52 47.95,41.92 47.02,42.85 47.02,43.19 47,43.17 44.04,43.17 43.49,42.62 43.49,41.98 ; 47.95,41.52 48.46,42.03 52.42,42.03 53.29,41.16 53.29,39.36 53.32,39.33 ; 33.96,45.01 33.96,43.69 34.66,42.99 ; 58.23,25.25 57.87,25.25 57.51,25.62 57.51,27.52 58.43,28.44 58.43,30.76 59.1,31.44 66.36,31.44 66.84,30.96 66.84,30.16 ; 59.16,31.46 59.16,38.31 57.08,40.4 53.33,40.4 ; 34.76,42.9 34.8,42.94 41.47,42.94 42.58,41.83 43.23,41.83
  Top Layer w0.762: 14.76,5.19 v1(14.76,6.94) ; 29.11,6.97 29.11,5.51 29.22,5.4 ; 25.5,39.96 25.5,45.2 25.45,45.25
  Bottom Layer w0.254: v1(41.56,38.07) 41.56,34 41.03,33.47 39.21,33.47 38.39,32.65 38.39,31.36 ; 35.04,19.92 36.74,19.92 36.75,19.91 ; v1(38.29,26.88) 38.29,23.6 37.91,23.21 37.85,23.16 ; v1(36.76,19.05) 36.76,20.38 37.91,21.53
  Bottom Layer w0.762: 37.91,23.21 36.89,24.23 30.77,24.23 28.96,22.43 28.96,8.75 28.2,7.99 15.81,7.99 v1(14.76,6.94) ; 28.68,8.23 29,7.91 29,7.02
  vias: v1(29.11,7.03) v1(31.09,46.02) v1(32.61,46.02) v1(34.97,19.92) v1(37.92,23.2) v1(37.92,21.62) v1(38.43,31.33) v1(38.51,28.88)
GND: length 62
  Top Layer w0.254: 48.43,38.43 48.43,38.51 v1(48.38,38.56) ; 48.43,38.43 45.09,38.43 ; 48.43,38.43 49.58,38.43 v1(49.89,38.13) v1(49.89,37.32) v1(49.89,36.55) v1(49.89,35.82) v1(49.89,35.12) v1(49.89,34.41) v1(49.89,33.69) 49.89,33.15 49.71,32.97 v1(48.61,32.97) 46.68,32.97 ; 48.43,38.43 X1.2 ; 41.46,32.72 42.47,32.72 43.49,33.73 43.49,35.76 44.12,36.4 v1(44.12,37.41) 44.12,38.05 44.51,38.43 45.09,38.43 ; 45.08,32.46 44.63,32.46 44.12,31.95 44.12,31.19 43.77,30.84 U1.10 ; 45.08,32.46 45.1,32.44 C23.1 ; 45.08,32.46 48.06,32.46 v1(48.32,32.21) 48.32,27.26 47.93,26.88 45.12,26.88 ; 37.8,40.6 37.8,40.79 38.09,41.08 38.45,41.08 ; 45.09,38.43 45.09,37.57 45.06,37.54 ; 41.23,29.25 v1(41.34,29.25) v1(42,29.25) 42.87,29.25 v1(42.89,29.23) 43.7,29.23 v1(43.71,29.22) 44.22,28.71 v1(44.22,28.61) 44.33,28.51 44.33,27.05 44.51,26.88 45.12,26.88 ; 45.11,32.97 44.51,32.97 43.3,31.77 ; 45.11,32.97 45.11,33.6 C21.1 ; 45.11,32.97 46.68,32.97 ; v1(36.57,23.13) 36.78,23.13 37.36,23.71 37.49,23.71 37.74,23.96 37.74,24.09 37.87,24.22 ; C22.1 45.12,27.58 45.12,26.88 ; 30.04,20.49 v1(30.04,19.58) ; 24.38,26.86 23.76,26.86 23.14,26.24 23.14,25.24 ; 46.68,32.97 X1.4 ; 46.68,32.97 46.68,32.83 v1(46.79,32.72)
  vias: v1(6.45,36.93) v1(12.55,6.45) v1(17.36,36.89) v1(18.37,36.95) v1(18.65,6.45) v1(23.13,25.23) v1(24.74,24.74) v1(24.74,12.55) v1(24.74,6.45) v1(28.81,42.26) v1(29.97,42.3) v1(30.84,43.03) v1(30.84,18.65) v1(30.84,12.55) v1(31.29,42.26) v1(32.32,42.26) v1(33.34,42.3) v1(36.47,21.17) v1(36.93,12.55) v1(36.93,6.45) v1(37.63,20.28) v1(38.43,34.52) v1(38.46,35.47) v1(38.86,20.31) v1(39,41.31) v1(39.1,39.93) v1(39.27,23.43) v1(39.84,22.06) v1(40.75,24.82) v1(40.74,23.51) v1(41.08,30.94) v1(41.88,30.94) v1(42,32.94) v1(42.73,33.22) v1(42.66,30.94) v1(42.8,25.26) v1(43.03,18.65) v1(43.03,12.55) v1(43.03,6.45) v1(43.29,35.42) v1(43.29,34.62) v1(43.29,33.76) v1(43.4,31.68) v1(43.46,30.94) v1(43.59,36.18) v1(43.92,24.79) v1(44,36.78) v1(44.12,38.18) v1(44.12,32.19) v1(44.12,31.39) v1(44.22,27.66) v1(44.22,26.88) v1(44.23,20.25) v1(44.5,42.3) v1(44.79,38.56) v1(44.89,32.72) v1(45.09,26.75) v1(45.36,42.33) v1(45.65,38.56) v1(45.81,41.43) v1(45.8,32.72) v1(45.93,26.75) v1(45.86,25.21) v1(46.24,42.38) v1(46.5,38.56) v1(46.6,22.06) v1(46.66,26.75) v1(47.03,25.22) v1(47.43,26.75) v1(47.47,38.56) v1(47.64,32.72) v1(48.32,27) v1(48.31,25.22) v1(48.44,31.45) v1(48.44,30.56) v1(48.44,29.68) v1(48.44,28.78) v1(48.44,27.89) v1(49.13,30.84) v1(49.13,24.74) v1(49.13,18.65) v1(49.13,12.55) v1(49.13,6.45) v1(49.2,38.56) v1(49.54,32.97) v1(52.7,34.25) v1(54.55,33.38) v1(54.57,31.97) v1(54.57,30.29) v1(54.64,28.62) v1(54.66,26.89) v1(54.66,25.21) v1(55.22,43.03) v1(55.22,30.84) v1(55.22,24.74) v1(55.22,12.55) v1(55.22,6.45) v1(56.42,38.54) v1(56.42,26.34) v1(57.53,36.97) v1(57.53,34.99) v1(57.57,33.42) v1(61.08,30.4) v1(61.32,36.93) v1(61.32,18.65) v1(61.32,12.55) v1(62.38,30.51) v1(62.98,29.39) v1(62.98,28.48) v1(63.78,30.5) v1(64.72,28.82) v1(67.41,43.03) v1(67.41,36.93) v1(67.41,24.74) v1(67.41,18.65) v1(67.41,12.55) v1(67.41,6.45) v1(68.44,30.53) v1(68.49,28.23) v1(68.58,25.98)
VCC: length 13.4
  Top Layer w1.27: 5.43,39.98 7.66,39.98 9.69,42.01 9.69,43.72 11.05,45.08 15.68,45.08
  vias: v1(14.17,42.24) v1(14.17,41.56) v1(15.53,46.75) v1(15.53,45.23) v1(15.53,43.71) v1(17.06,46.75) v1(17.06,45.23) v1(18.58,46.75) v1(18.58,45.23) v1(18.97,42.25) v1(18.97,41.55)
A0: length 48.6
  Top Layer w0.254: U1.23 38.33,37.34 37.42,36.42 v1(37.42,36.4)
  Bottom Layer w0.254: v1(37.42,36.4) 37.42,33.31 30.7,26.6 10.96,26.6 9.58,25.22 9.58,19.64 8.3,18.35 5.5,18.35 5.14,17.98 U15.19
A1: length 47.3
  Top Layer w0.254: v1(36.82,31.89) 36.83,31.9 36.83,36.73 37.94,37.84 U1.24
  Bottom Layer w0.254: U15.20 7.68,17.23 9.94,19.49 9.94,25.07 11.1,26.24 31.93,26.24 36.82,31.13 v1(36.82,31.89)
A2: length 46.4
  Top Layer w0.254: v1(36.25,36.44) 36.25,36.91 37.68,38.34 U1.25
  Bottom Layer w0.254: v1(36.25,36.44) 36.25,34.05 29.51,27.31 10.66,27.31 8.87,25.51 8.87,21.59 8.31,21.03 6.41,21.03 U15.17
A3: length 45
  Top Layer w0.254: U1.26 38.31,38.97 38.03,38.69 37.53,38.69 35.67,36.83 35.67,32.67 v1(35.68,32.65)
  Bottom Layer w0.254: v1(35.68,32.65) 35.68,32.08 30.55,26.95 10.81,26.95 9.22,25.37 9.22,20.8 8.18,19.76 U15.18
A4: length 40.8
  Top Layer w0.254: v1(12.91,29.38) 12.86,29.38 9.2,25.73 9.2,24.59 8.18,23.57 6.41,23.57 U15.15 ; v1(34.85,36.4) 34.85,36.65 36.81,38.61 U1.29
  Bottom Layer w0.254: v1(34.85,36.4) 34.85,35.95 29.46,30.56 15.04,30.56 13.9,29.42 12.95,29.42 v1(12.91,29.38)
A5: length 38
  Top Layer w0.254: U15.16 9.96,24.59 9.96,25.6 13.53,29.17 v1(13.53,30) ; v1(34.12,36.05) 34.12,36.69 36.31,38.88 U1.30
  Bottom Layer w0.254: v1(13.53,30) 14.57,31.04 29.05,31.04 30.74,32.73 30.8,32.73 v1(34.12,36.05)
BOOT0: length 8.7
  Top Layer w0.254: R21.1 38.72,21.03 ; SW4.1 37.65,21.03 35.31,23.37 U1.94
BOOT1: length 29.7
  Top Layer w0.254: R22.2 39.75,18.19 40.31,18.75 40.31,19.64 SW4.2 41.46,19.76 42.09,20.4 42.09,22.05 41.58,22.56 40.45,22.56 40.06,22.95 40.06,24.39 38.53,25.91 37.18,25.91 36.76,26.34 36.76,30.18 32.82,34.11 32.82,39.88 U1.37
D0: length 40.1
  Top Layer w0.254: U1.95 35.81,29.98 33.53,32.26 29.66,32.26 29.38,32.54 v1(28.9,32.54)
  Bottom Layer w0.254: v1(28.9,32.54) 28.2,32.54 27.41,31.75 13.82,31.75 8.18,26.11 6.79,26.11 5.52,24.84 U15.13
D1: length 38.6
  Top Layer w0.254: v1(30.15,32.97) 33.46,32.97 36.31,30.11 U1.96
  Bottom Layer w0.254: U15.14 7.68,24.97 14.1,31.4 28.58,31.4 v1(30.15,32.97)
D2: length 29.6
  Top Layer w0.254: v1(27.9,37.13) 27.87,37.16 27.87,39.83 U1.47
  Bottom Layer w0.254: U15.11 6.41,28.65 8.18,28.65 11.48,31.95 12.37,31.95 14.28,33.86 20.47,33.86 23.14,36.53 27.29,36.53 v1(27.9,37.13)
D3: length 26.9
  Top Layer w0.254: U1.48 27.31,36.27 v1(26.89,35.84)
  Bottom Layer w0.254: v1(26.89,35.84) 22.96,35.84 20.62,33.5 14.56,33.5 12.37,31.32 11.61,31.32 U15.12
D4: length 23.4
  Top Layer w0.254: v1(19.99,36.91) 21.42,38.34 U1.51 ; v1(11.68,34.63) 11.44,34.63 8,31.19 5.9,31.19 5.14,30.43 U15.9
  Bottom Layer w0.254: v1(11.68,34.63) 12.44,35.38 18.47,35.38 v1(19.99,36.91)
D5: length 20.4
  Top Layer w0.254: U15.10 8.06,29.92 12.7,34.57 v1(12.76,34.57) ; v1(20.76,36.78) 21.81,37.84 U1.52
  Bottom Layer w0.254: v1(20.76,36.78) 19,35.03 13.21,35.03 v1(12.76,34.57)
D6: length 21.6
  Top Layer w0.254: U1.53 22.2,37.34 v1(21.52,36.65)
  Bottom Layer w0.254: v1(21.52,36.65) 19.54,34.67 13.82,34.67 12.76,33.61 6.28,33.61 U15.7
D7: length 18.9
  Top Layer w0.254: U1.54 22.62,36.84 v1(22.28,36.49)
  Bottom Layer w0.254: v1(22.28,36.49) 20.03,34.24 14.03,34.24 12.25,32.46 U15.8
D+: length 18.6
  Top Layer w0.254: v1(22.36,27.99) 22.7,28.34 U1.71 ; R20.2 14.41,37.62 14.41,37.16 16.3,35.27 16.3,30.05 v1(18.42,27.92)
  Bottom Layer w0.254: v1(18.42,27.92) 18.5,27.99 v1(22.36,27.99)
D-: length 16.6
  Top Layer w0.254: U1.70 22.36,28.84 v1(22.28,28.75) ; R19.2 16.31,36.78 16.92,36.17 16.92,30.33 18.48,28.76 v1(18.85,28.76)
  Bottom Layer w0.254: v1(18.85,28.76) 22.27,28.76 v1(22.28,28.75)
DN: length 6.5
  Top Layer w0.254: 16.31,38.99 16.31,39.7 17.32,40.71 USBC1.B7 17.32,42.89 17.07,43.13 16.57,43.13 16.31,42.88 16.31,41.93 USBC1.A7
DP: length 10
  Top Layer w0.254: USBC1.B6 15.82,41.09 16.06,40.84 16.57,40.84 16.82,41.1 16.82,41.92 USBC1.A6 ; 14.91,38.99 14.91,39.7 15.3,40.08 16.06,40.08 16.24,40.26 v1(16.24,40.8) ; v1(19.11,40.34) R14.1
  Bottom Layer w0.254: v1(19.11,40.34) 18.64,40.8 v1(16.24,40.8)
FD: length 37.5
  Top Layer w0.254: v1(18.98,24.33) 18.98,25.33 19.99,26.34 19.99,32.72 21.11,33.84 U1.60
  Bottom Layer w0.254: v1(18.98,24.33) 18.57,23.93 18.57,13.01 16.82,11.25 8.56,11.25 U15.24
K: length 9.7
  Top Layer w0.254: FPC2.13 58.38,26.97 58.35,27 ; 58.35,27 58.35,27.26 58.57,27.47 FPC2.14 60.92,27.47 61.4,27 v1(61.4,26.75) ; 58.35,27 58.35,26.43 ; FPC2.12 58.39,26.47 58.35,26.43 ; 58.35,26.43 58.35,26.24 58.61,25.97 FPC2.11
  Top Layer w0.508: v1(61.4,26.75) 62.03,26.11 R15.2
LED: length 63.1
  Top Layer w0.254: v1(29.14,27.89) v1(34.98,27.89) ; v1(66.48,25.6) 66.94,26.07 R25.1 ; v1(26.38,29.97) 26.38,32.59 26.13,32.84 U1.62
  Bottom Layer w0.254: v1(66.48,25.6) 65.57,24.7 56.04,24.7 54.67,23.32 54.67,21.29 53.27,19.89 53.27,16.71 52.38,15.83 49.46,15.83 48.06,17.22 48.06,22.18 42.35,27.89 v1(34.98,27.89) ; v1(29.14,27.89) 26.98,27.89 26.38,28.49 26.38,29.97
OSK: length 40.5
  Top Layer w0.254: v1(17.91,23.71) 17.91,25.05 19.61,26.75 19.61,32.84 21.11,34.34 U1.59
  Bottom Layer w0.254: U15.21 6.41,13.41 8,13.41 9.53,11.89 16.44,11.89 17.91,13.36 v1(17.91,23.71)
PA9: length 32.8
  Top Layer w0.254: FPC1.2 16.07,28.41 v1(16.57,28.91) ; v1(22.73,29.97) 23.12,29.97 23.26,29.84 U1.68
  Bottom Layer w0.254: v1(22.73,29.97) 22.7,30 17.66,30 v1(16.57,28.91)
PA10: length 31.1
  Top Layer w0.254: U1.69 21.73,29.34 v1(21.64,29.42) ; FPC1.3 v1(17.32,28.14)
  Bottom Layer w0.254: v1(17.32,28.14) 18.59,29.41 21.64,29.41 v1(21.64,29.42)
PA13: length 34.8
  Top Layer w0.254: U1.72 23.75,27.84 22.54,26.63 22.54,23.96 19.49,20.91 19.49,10.87 21.39,8.97 29.52,8.97 30.42,8.07 FPC4.2
PA14: length 34.7
  Top Layer w0.254: FPC4.3 31.67,8.85 31.17,9.35 21.9,9.35 20.12,11.13 20.12,21.03 20.88,21.79 24.82,21.79 26.31,23.29 U1.76
PA15: length 51.3
  Top Layer w0.254: U1.77 26.81,23.03 25.45,21.67 25.45,15.32 27.11,13.67 32.44,13.67 34.73,15.95 46.03,15.95 46.87,15.12 52.31,15.12 53.34,16.15 53.34,19.32 57,22.97 FPC2.5
PB3: length 41.4
  Top Layer w0.254: FPC2.3 57.01,21.97 54.05,19.02 54.05,15.85 52.61,14.4 46.18,14.4 45.93,14.66 36.78,14.66 v1(36.76,14.68) ; v1(32.63,22.06) 32.81,22.24 U1.89
  Bottom Layer w0.254: v1(32.63,22.06) 32.63,16.27 34.22,14.68 v1(36.76,14.68)
PB4: length 41.8
  Top Layer w0.254: U1.90 33.31,21.14 v1(33.8,20.65) ; FPC2.7 59.64,23.99 v1(56.68,23.99)
  Bottom Layer w0.254: v1(56.68,23.99) 55.94,23.24 55.94,21.16 53.9,19.13 53.9,16.33 52.25,14.68 46.54,14.68 45.22,16 34.55,16 33.57,16.98 33.57,18.6 33.8,18.83 v1(33.8,20.65)
PB5: length 39.5
  Top Layer w0.254: FPC2.6 57,23.47 52.99,19.46 52.99,16.3 52.16,15.47 47.4,15.47 46.28,16.59 v1(39.42,16.59) ; v1(33.9,21.86) 33.81,21.95 U1.91
  Bottom Layer w0.254: v1(33.9,21.86) 33.9,21.43 34.38,20.94 34.38,18.91 34.05,18.57 34.05,17.08 34.54,16.59 v1(39.42,16.59)
PB6: length 17
  Top Layer w0.254: U1.92 34.31,23.32 35.13,22.5 35.13,20.92 34.21,20 32.17,20 31.68,19.51 31.68,18.98 32.17,18.49 32.83,18.49 FPC3.3 33.66,18.49 33.92,18.74 34.92,18.74 35.21,18.45 35.21,17.37 35.49,17.1 37.01,17.1 37.39,17.48 R24.1
PB7: length 10.2
  Top Layer w0.254: 35.02,19.15 33.82,19.15 33.66,18.99 FPC3.2 ; R11.1 35.98,18.19 35.06,19.11 35.88,19.93 35.88,22.3 34.88,23.29 34.88,24.71 U1.93
PC0: length 16.9
  Top Layer w0.254: LED2.1 51.2,40.04 50.73,39.57 43.87,39.57 42.96,38.66 42.96,37.09 42.35,36.48 42.35,34.75 40.93,33.34 U1.15
PC8: length 36.7
  Top Layer w0.254: U1.65 21.15,31.34 20.38,30.56 20.38,25.86 19.8,25.29 v1(19.8,25.03)
  Bottom Layer w0.254: v1(19.8,25.03) 19.8,11.83 17.58,9.6 U15.26
PC9: length 38.4
  Top Layer w0.254: v1(19.16,23.45) 19.16,23.56 20.73,25.13 20.73,30.41 21.16,30.84 U1.66
  Bottom Layer w0.254: v1(19.16,23.45) 19.16,12.07 17.82,10.73 6.55,10.73 U15.23
PC10: length 37
  Top Layer w0.254: v1(26.6,21.67) 27.24,22.31 27.24,24.71 U1.78
  Bottom Layer w0.254: U15.22 9.96,12.4 15.55,12.4 16.95,13.79 16.95,24.84 17.84,25.73 20.38,25.73 24.44,21.67 v1(26.6,21.67)
PC11: length 36.4
  Top Layer w0.254: U1.79 27.81,33.53 v1(26.85,34.49) ; v1(15.71,32.34) 14.98,32.34 13.92,33.39 13.92,34.34 12.5,35.76 10.34,35.76 8.31,33.73 6.41,33.73 U15.5
  Bottom Layer w0.254: v1(26.85,34.49) 26.45,34.9 23.19,34.9 20.63,32.34 v1(15.71,32.34)
PC12: length 33.9
  Top Layer w0.254: v1(27.49,35.13) 28.31,34.3 U1.80 ; v1(15.22,32.92) 14.28,33.86 14.28,34.62 12.63,36.27 9.33,36.27 8.06,35 U15.6
  Bottom Layer w0.254: v1(15.22,32.92) 20.58,32.92 22.92,35.26 27.36,35.26 v1(27.49,35.13)
PD6: length 41.4
  Top Layer w0.254: v1(31.73,23.35) 31.81,23.43 U1.87 ; FPC2.4 57,22.47 53.7,19.17 53.7,16 52.46,14.76 46.59,14.76 46.03,15.32 v1(37.65,15.32)
  Bottom Layer w0.254: v1(37.65,15.32) 34.47,15.32 33.21,16.58 33.21,22.3 32.17,23.35 v1(31.73,23.35)
PD7: length 42.1
  Top Layer w0.254: v1(32.05,21.08) 32.05,22.76 32.31,23.03 U1.88 ; FPC2.2 57.01,21.47 54.41,18.87 54.41,15.7 52.76,14.05 v1(42.6,14.05)
  Bottom Layer w0.254: v1(32.05,21.08) 32.05,16.22 34.22,14.05 v1(42.6,14.05)
PE4: length 18
  Top Layer w0.254: U1.3 40.62,27.34 41.38,26.57 v1(41.38,25.68) ; FPC3.4 32.91,18.06 33.91,18.06 33.93,18.08 v1(34.63,18.08)
  Bottom Layer w0.254: v1(34.63,18.08) 39.9,18.08 41.38,19.56 v1(41.38,25.68)
PE5: length 20.3
  Top Layer w0.254: FPC3.5 32.85,17.48 34.47,17.48 v1(34.63,17.32) ; v1(41.97,27.28) 41.41,27.84 U1.4
  Bottom Layer w0.254: v1(34.63,17.32) 39.9,17.32 41.97,19.38 v1(41.97,27.28)
RST: length 27.3
  Top Layer w0.254: C34.2 54.88,38.52 54.54,38.18 54.28,38.18 54.16,38.3 52.76,38.3 52.38,38.69 52.38,39.19 ; R18.1 51.62,39.32 51.11,38.81 51.11,36.37 Reset.2 50.86,36.02 50.48,36.4 50.48,38.56 49.84,39.19 44.25,39.19 43.36,38.3 43.36,36.91 42.7,36.25 42.7,34.47 41.07,32.84 U1.14
VREF: length 11.3
  Top Layer w0.254: U1.21 39.87,36.35 41.08,36.35 41.08,36.84 U1.22
  Top Layer w0.508: 41.2,36.65 41.84,36.65 42.47,37.29 42.47,39.83 43.07,40.43 C26.2 C27.2
X1-8M: length 11.1
  Top Layer w0.254: 39.99,31.84 42.73,31.84 44.23,33.33 44.23,34.49 44.53,34.79 C21.2 45.11,34.79 45.96,35.64 47.39,35.64 48.24,34.79 48.3,34.79 X1.1
X1-32K: length 7.8
  Top Layer w0.254: X2.2 45.49,28.27 43.92,29.84 U1.8
X2-8M: length 10.2
  Top Layer w0.254: 39.99,32.34 42.73,32.34 43.87,33.48 43.87,35.64 44.68,36.45 C20.2 45.06,36.36 45.39,36.02 45.83,36.02 X1.3
X2-32K: length 7.4
  Top Layer w0.254: X2.1 46.79,30.56 44.25,30.56 44.03,30.34 U1.9
$1N2566: length 3.5
  Top Layer w0.254: 13.39,38.99 14.82,40.42 USBC1.B5
$1N2567: length 2.9
  Top Layer w0.254: USBC1.A5 17.82,39.23 R12.2
$1N2763: length 1.6
  Top Layer w0.254: LED1.2 49.47,43.26 R17.1
$1N2765: length 1.8
  Top Layer w0.254: LED2.2 49.29,40.54 R16.1
$1N3601: length 4.6
  Top Layer w0.254: 66.04,27.82 R23.2 NC1.2 ; 66.04,27.82 66.03,27.83 64.16,27.83 ; 66.04,27.82 66.04,27.39 R25.2
$1N3606: length 3.9
  Top Layer w0.254: R15.1 63.67,26.76 62.92,27.51 62.16,27.51 61.69,27.98 Q3.3

## Copper pours and planes (outline as drawn; the poured copper is in the pictures)
3V3 on Top Layer: 24.86,40.69 26.49,40.69 26.49,39.13 24.86,39.13
3V3 on Top Layer: 21.84,46.72 34.41,46.72 34.41,44.4 21.84,44.4
GND on Top Layer: -12.63,59.72 86.45,59.72 86.45,-8.5 -12.63,-8.5
GND on Bottom Layer: -1.21,52.94 72.34,52.94 72.34,-1.47 -1.21,-1.47
VCC on Top Layer: 34.63,48.66 36.32,48.66 36.32,43.86 34.63,43.86
VCC on Top Layer: 28.54,48.72 36.33,48.72 36.33,46.97 28.54,46.97
VCC on Top Layer: 13.91,48.09 19.2,48.09 19.2,42.08 13.91,42.08
VCC on Top Layer: 13.92,48.75 28.67,48.75 28.67,46.92 13.92,46.92

## Text on the board
Top Solder Mask Layer: @Eliauk
